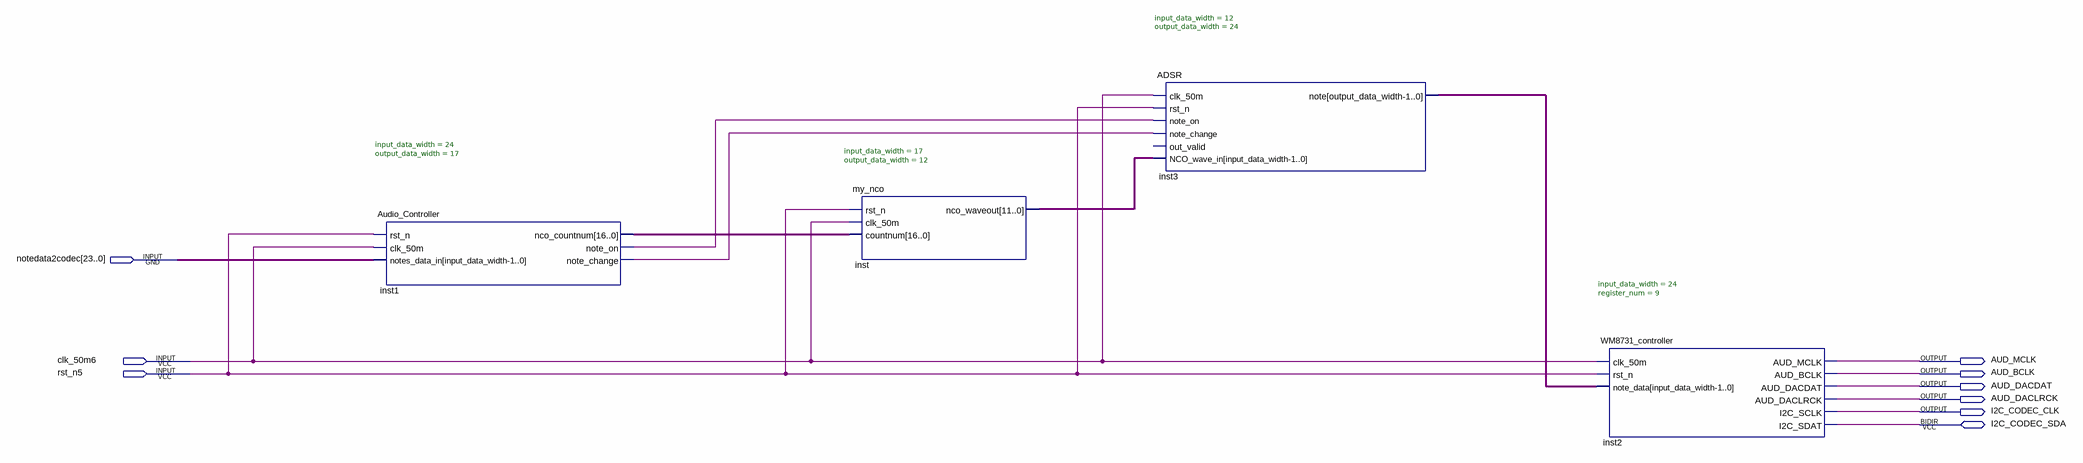
[diagram p0: schematic sheet]
// Quartus schematic audio_test.bdf as structural Verilog: 4 symbols, 9 pins
module audio_test (
  input  [23:0] notedata2codec,
  input  clk_50m6,
  input  rst_n5,
  inout  I2C_CODEC_SDA,
  output AUD_MCLK,
  output AUD_BCLK,
  output AUD_DACDAT,
  output AUD_DACLRCK,
  output I2C_CODEC_CLK
);

  wire inst1_note_change, inst1_note_on;
  wire [11:0] inst_nco_waveout;
  wire [16:0] inst1_nco_countnum;
  wire [23:0] inst3_note;

  Audio_Controller #(.input_data_width(24), .output_data_width(17)) inst1 (
    .rst_n(rst_n5), .clk_50m(clk_50m6), .notes_data_in(notedata2codec), .nco_countnum(inst1_nco_countnum),
    .note_on(inst1_note_on), .note_change(inst1_note_change));
  my_nco #(.input_data_width(17), .output_data_width(12)) inst (
    .rst_n(rst_n5), .clk_50m(clk_50m6), .countnum(inst1_nco_countnum), .nco_waveout(inst_nco_waveout));
  ADSR #(.input_data_width(12), .output_data_width(24)) inst3 (
    .clk_50m(clk_50m6), .rst_n(rst_n5), .note_on(inst1_note_on), .note_change(inst1_note_change),
    .NCO_wave_in(inst_nco_waveout), .note(inst3_note));  // open: out_valid
  WM8731_controller #(.input_data_width(24), .register_num(9)) inst2 (
    .clk_50m(clk_50m6), .rst_n(rst_n5), .note_data(inst3_note), .AUD_MCLK(AUD_MCLK), .AUD_BCLK(AUD_BCLK),
    .AUD_DACDAT(AUD_DACDAT), .AUD_DACLRCK(AUD_DACLRCK), .I2C_SCLK(I2C_CODEC_CLK), .I2C_SDAT(I2C_CODEC_SDA));
endmodule
